# EAGLE schematic Schematic_Light Project (EAGLE 9.2.0)
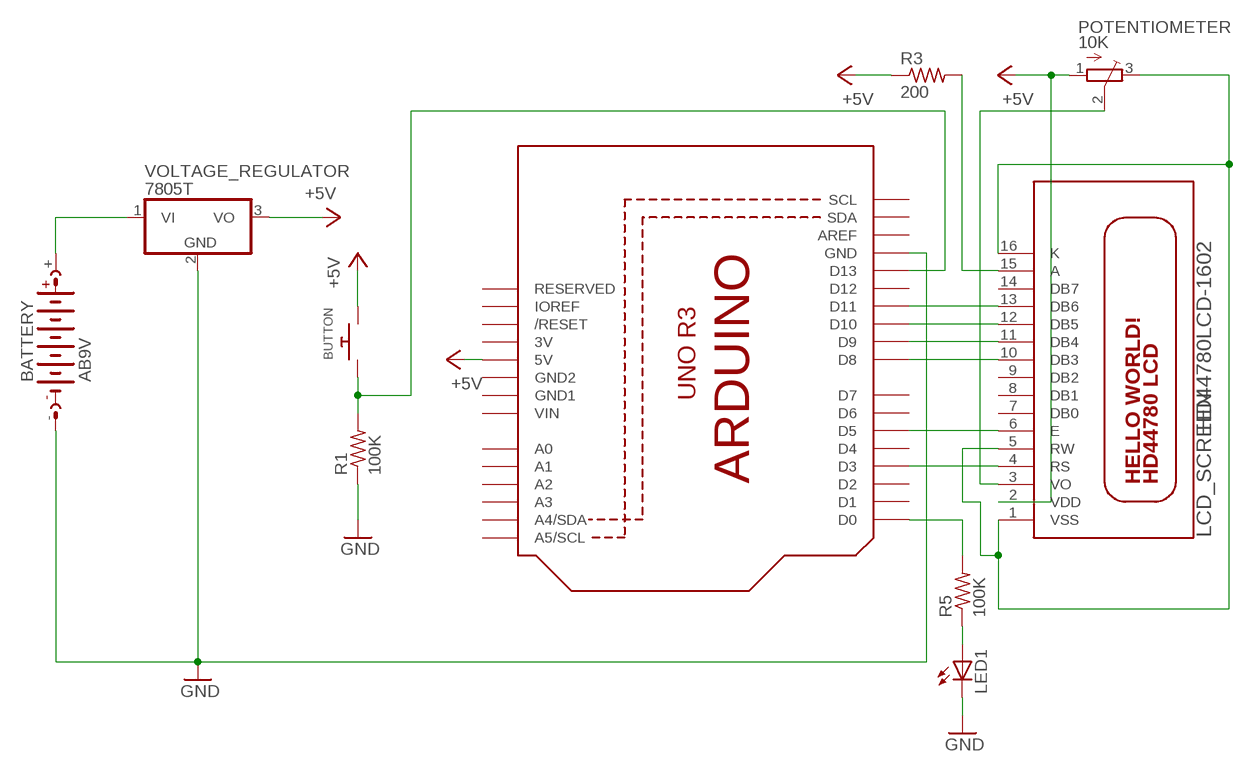
[diagram p0: schematic, sheet 1]

## Parts
ARDUINO  ARDUINOR3-DIMENSION  [ARDUINOR3]
BATTERY  AB9V  [AB9V]
BUTTON  SWITCH_PUSHBUTTONSOFTTOUCHSMD_SJ  [PUSHBUTTON_SMD_SJ]
LCD_SCREEN  HD44780LCD-1602  [LCD1602]
LED1  LED5MM  [LED5MM]
POTENTIOMETER  10K  TRIMPOT3386  [TRIM-3386]
R1  100K  R-US_M0805  [M0805]
R3  200  R-US_M0805  [M0805]
R5  100K  R-US_M0805  [M0805]
VOLTAGE_REGULATOR  7805T  [TO220H]

## Nets
+5V: ARDUINO.5V BUTTON.P$2 LCD_SCREEN.2(VDD) POTENTIOMETER.1(A) R3.1 VOLTAGE_REGULATOR.3(VO)
GND: ARDUINO.GND BATTERY.- LED1.K(C) R1.1 VOLTAGE_REGULATOR.2(GND)
N$1: BATTERY.+ VOLTAGE_REGULATOR.1(VI)
N$5: ARDUINO.D13 BUTTON.P$1 R1.2
N$8: ARDUINO.D0 R5.2
N$9: LED1.A R5.1
N$11: ARDUINO.D10 LCD_SCREEN.12(DB5)
N$12: ARDUINO.D9 LCD_SCREEN.11(DB4)
N$13: ARDUINO.D8 LCD_SCREEN.10(DB3)
N$14: ARDUINO.D5 LCD_SCREEN.6(E)
N$15: ARDUINO.D3 LCD_SCREEN.4(RS)
N$16: LCD_SCREEN.3(VO) POTENTIOMETER.2(S)
N$17: LCD_SCREEN.15(A) R3.2
N$20: ARDUINO.D11 LCD_SCREEN.13(DB6)
VSS: LCD_SCREEN.1(VSS) LCD_SCREEN.5(RW) LCD_SCREEN.16(K) POTENTIOMETER.3(E)
Unconnected: ARDUINO.A0 ARDUINO.A1 ARDUINO.A2 ARDUINO.A3 ARDUINO.A4(A4/SDA) ARDUINO.A5(A5/SCL) ARDUINO.AREF ARDUINO.D1 ARDUINO.D2 ARDUINO.D4 ARDUINO.D6 ARDUINO.D7 ARDUINO.D12 ARDUINO.IOREF ARDUINO.RESERVED ARDUINO.RESET(/RESET) ARDUINO.SCL ARDUINO.SDA LCD_SCREEN.7(DB0) LCD_SCREEN.8(DB1) LCD_SCREEN.9(DB2) LCD_SCREEN.14(DB7)

## Power pins joined to a net without a drawn wire
3V: ARDUINO.3V
GND1: ARDUINO.GND1
GND2: ARDUINO.GND2
VIN: ARDUINO.VIN

## Library data of the parts
ARDUINO = adafruit:ARDUINOR3: This is a new object for the new Arduino R3 - with extra pins that you may want to use (such as IOref, and duplicated A4/A5
BATTERY = battery:AB9V: 9-V BATTERY CLIP
BUTTON = adafruit:SWITCH_PUSHBUTTON: Buttons SOFTTOUCHSMD_SJ - Soft touch temporary push button (Super Junk Akihabara) Compatible with SKPMANE010 [Mouser: 688-SKPMAN] C&K_KSS = Digikey: KSS221GLFS
LCD_SCREEN = adafruit:HD44780LCD: HD44780 LCD Standard character type LCDs, available in sizes from 8x1 to 40x4!
LED1 = adafruit:LED: LED OSRAM: - CHIPLED LG R971, LG N971, LY N971, LG Q971, LY Q971, LO R971, LY R971 LH N974, LH R974 LS Q976, LO Q976, LY Q976 LO Q996 - Hyper CHIPLED LW Q18S LB Q993, LB Q99A, LB R99A - SideLED LS A670, LO A670, LY A670, LG A670, LP A670 LB A673, LV A673, LT A673, LW A673 LH A674 LY A675 LS A676, LA A676, LO A676, LY A676, LW A676 LS A679, LY A679, LG A679 - Hyper Micro SIDELED® LS Y876, LA Y876, LO Y876, LY Y876 LT Y87S - SmartLED LW L88C, LW L88S LB L89C, LB L89S, LG L890 LS L89K, LO L89K, LY L89K LS L896, LA L896, LO L896, LY L896 - TOPLED LS T670, LO T670, LY T670, LG T670, LP T670 LSG T670, LSP T670, LSY T670, LOP T670, LYG T670 LG T671, LOG T671, LSG T671 LB T673, LV T673, LT T673, LW T673 LH T674 LS T676, LA T676, LO T676, LY T676, LB T676, LH T676, LSB T676, LW T676 LB T67C, LV T67C, LT T67C, LS T67K, LO T67K, LY T67K, LW E67C LS E67B, LA E67B, LO E67B, LY E67B, LB E67C, LV E67C, LT E67C LW T67C LS T679, LY T679, LG T679 LS T770, LO T770, LY T770, LG T770, LP T770 LB T773, LV T773, LT T773, LW T773 LH T774 LS E675, LA E675, LY E675, LS T675 LS T776, LA T776, LO T776, LY T776, LB T776 LHGB T686 LT T68C, LB T68C - Hyper Mini TOPLED® LB M676 - Mini TOPLED Santana® LG M470 LS M47K, LO M47K, LY M47K Source: http://www.osram.convergy.de/
POTENTIOMETER = adafruit:TRIMPOT: SMT trimmer potentiometer part number TC33X http://www.ladyada.net/library/eagle
R1 R3 R5 = adafruit:R-US_: RESISTOR, American symbol
VOLTAGE_REGULATOR = adafruit:78*: Positive VOLTAGE REGULATOR Added bigger pads to the TO-92 package